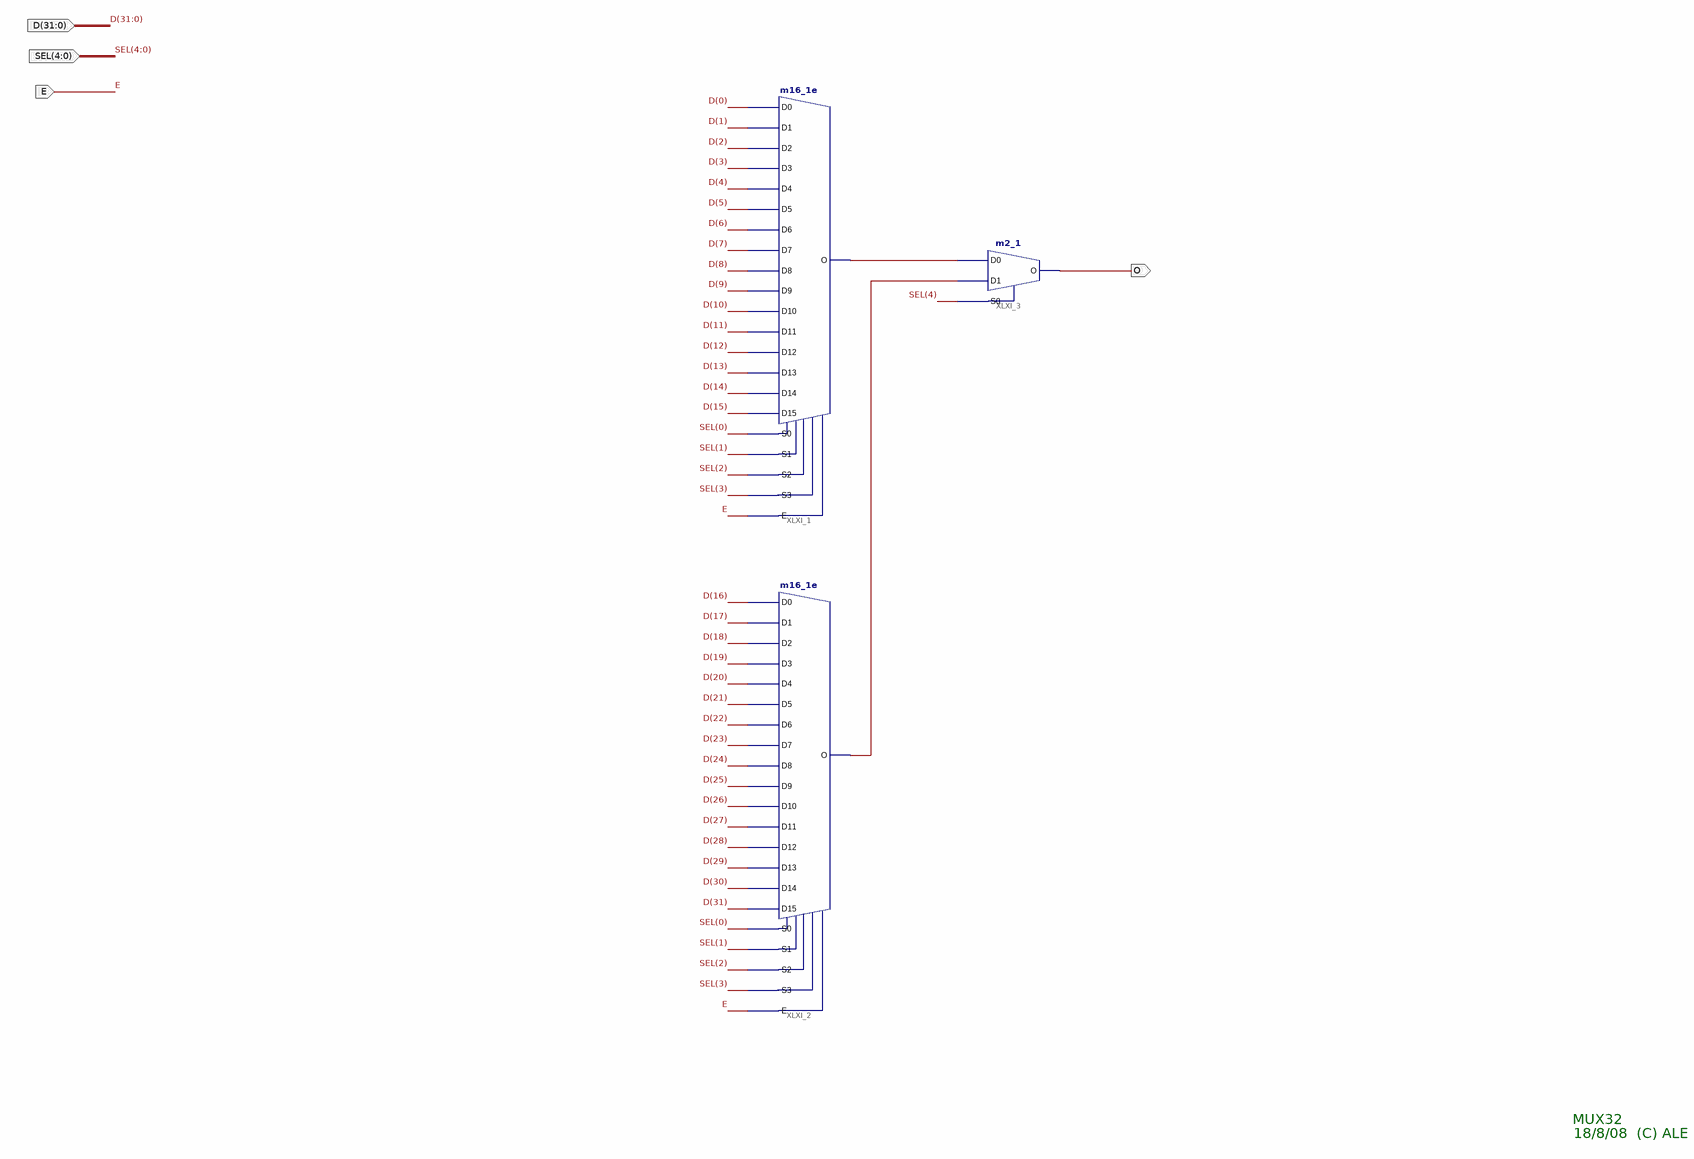
[diagram p0: schematic sheet 1]
// Xilinx ISE schematic Mux32.sch (spartan3e) as structural Verilog: 3 symbols, 4 ports
module Mux32 (
  input  [31:0] D,
  input  [4:0] SEL,
  input  E,
  output O
);

  wire XLXN_22, XLXN_54;

  m16_1e XLXI_2 (
    .D0(D[16]), .D1(D[17]), .D10(D[26]), .D11(D[27]), .D12(D[28]), .D13(D[29]), .D14(D[30]), .D15(D[31]),
    .D2(D[18]), .D3(D[19]), .D4(D[20]), .D5(D[21]), .D6(D[22]), .D7(D[23]), .D8(D[24]), .D9(D[25]), .E(E),
    .S0(SEL[0]), .S1(SEL[1]), .S2(SEL[2]), .S3(SEL[3]), .O(XLXN_54));
  m16_1e XLXI_1 (
    .D0(D[0]), .D1(D[1]), .D10(D[10]), .D11(D[11]), .D12(D[12]), .D13(D[13]), .D14(D[14]), .D15(D[15]),
    .D2(D[2]), .D3(D[3]), .D4(D[4]), .D5(D[5]), .D6(D[6]), .D7(D[7]), .D8(D[8]), .D9(D[9]), .E(E),
    .S0(SEL[0]), .S1(SEL[1]), .S2(SEL[2]), .S3(SEL[3]), .O(XLXN_22));
  m2_1 XLXI_3 (.D0(XLXN_22), .D1(XLXN_54), .S0(SEL[4]), .O(O));

  // Notes on the sheet:
  //   MUX32
  //   18/8/08  (C) ALE
endmodule
